# Altium schematic sheet OSPLC2_2_IO4.SchDoc
size 294 x 198 mm
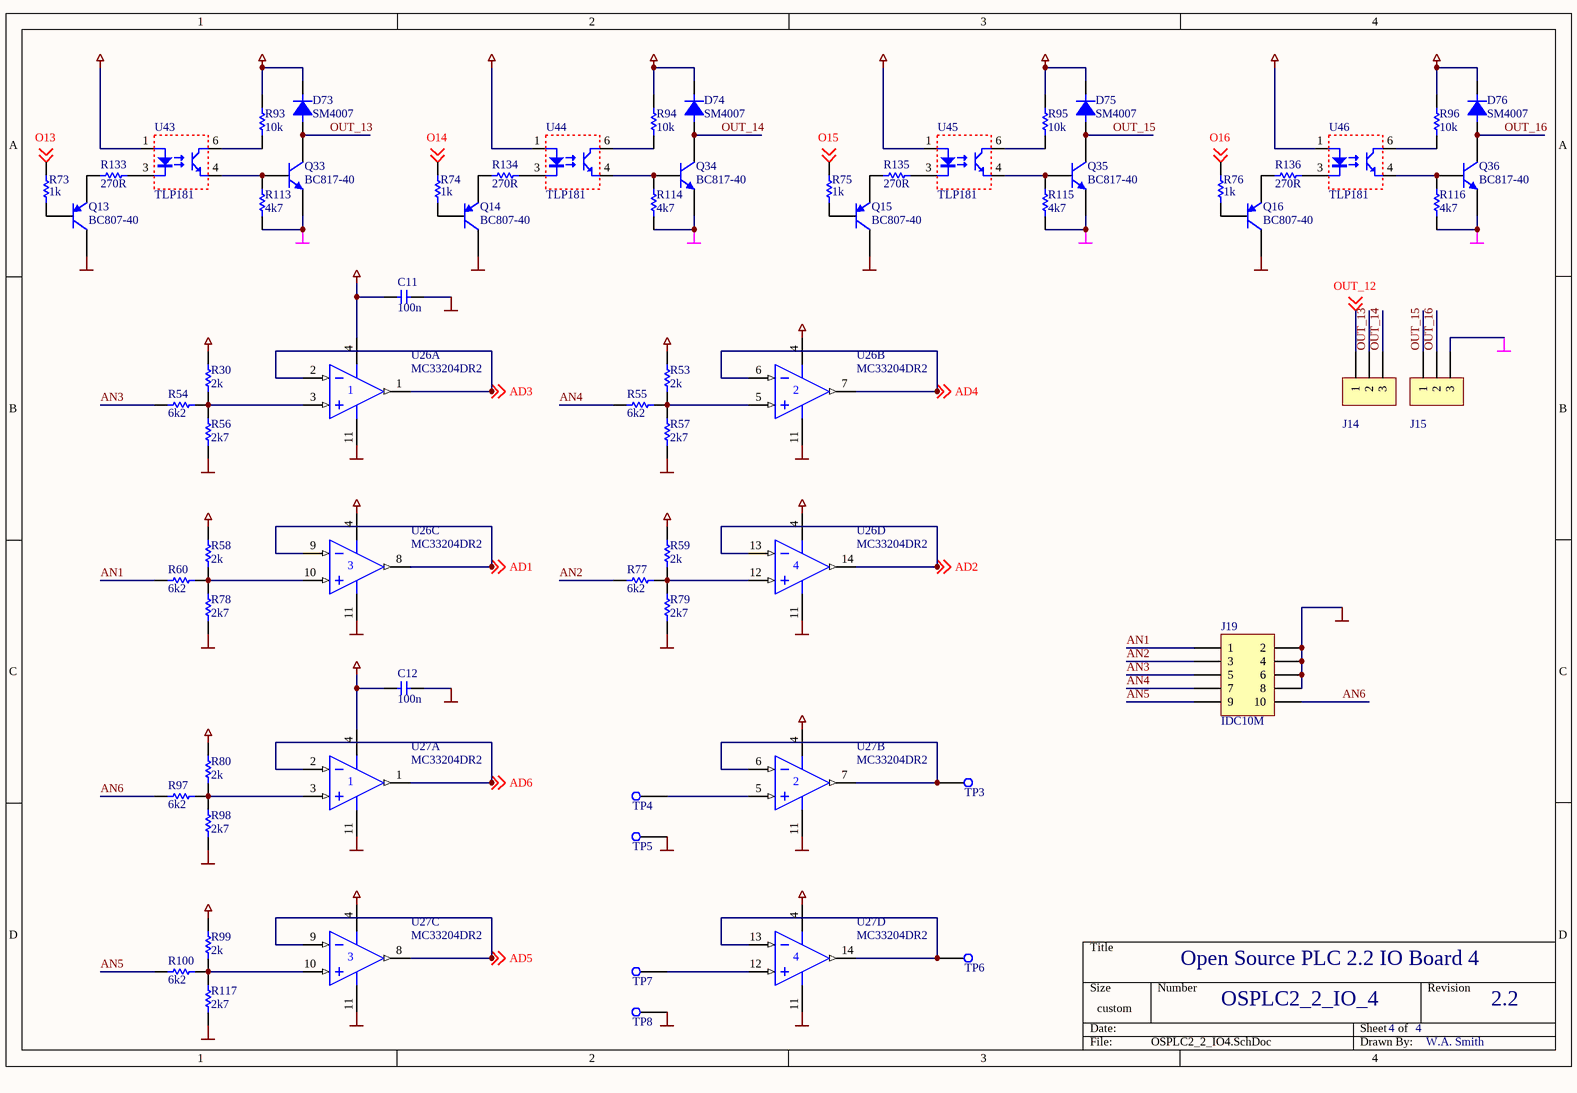
[diagram p0: OSPLC2_2_IO4.SchDoc]

## Parts
C11  value 100n  [0603]  (hidden comment: 0603)
C12  value 100n  [0603]  (hidden comment: 0603)
D73  SM4007  [MELF-2.2x2.5]
D74  SM4007  [MELF-2.2x2.5]
D75  SM4007  [MELF-2.2x2.5]
D76  SM4007  [MELF-2.2x2.5]
J14  PCB TERMINAL  [TERMINAL_3WAY_5MM]  (value not drawn)
J15  PCB TERMINAL  [TERMINAL_3WAY_5MM]  (value not drawn)
J19  IDC10M  [IDC_10M_BOX]
Q13  BC807-40  [SO-G3/Y1]
Q14  BC807-40  [SO-G3/Y1]
Q15  BC807-40  [SO-G3/Y1]
Q16  BC807-40  [SO-G3/Y1]
Q33  BC817-40  [SO-G3/Y1]
Q34  BC817-40  [SO-G3/Y1]
Q35  BC817-40  [SO-G3/Y1]
Q36  BC817-40  [SO-G3/Y1]
R30  value 2k  [0805]  (hidden comment: 0805)
R53  value 2k  [0805]  (hidden comment: 0805)
R54  value 6k2  [0805]  (hidden comment: 0805)
R55  value 6k2  [0805]  (hidden comment: 0805)
R56  value 2k7  [0805]  (hidden comment: 0805)
R57  value 2k7  [0805]  (hidden comment: 0805)
R58  value 2k  [0805]  (hidden comment: 0805)
R59  value 2k  [0805]  (hidden comment: 0805)
R60  value 6k2  [0805]  (hidden comment: 0805)
R73  value 1k  [0805]  (hidden comment: 0805)
R74  value 1k  [0805]  (hidden comment: 0805)
R75  value 1k  [0805]  (hidden comment: 0805)
R76  value 1k  [0805]  (hidden comment: 0805)
R77  value 6k2  [0805]  (hidden comment: 0805)
R78  value 2k7  [0805]  (hidden comment: 0805)
R79  value 2k7  [0805]  (hidden comment: 0805)
R80  value 2k  [0805]  (hidden comment: 0805)
R93  value 10k  [0805]  (hidden comment: 0805)
R94  value 10k  [0805]  (hidden comment: 0805)
R95  value 10k  [0805]  (hidden comment: 0805)
R96  value 10k  [0805]  (hidden comment: 0805)
R97  value 6k2  [0805]  (hidden comment: 0805)
R98  value 2k7  [0805]  (hidden comment: 0805)
R99  value 2k  [0805]  (hidden comment: 0805)
R100  value 6k2  [0805]  (hidden comment: 0805)
R113  value 4k7  [0805]  (hidden comment: 0805)
R114  value 4k7  [0805]  (hidden comment: 0805)
R115  value 4k7  [0805]  (hidden comment: 0805)
R116  value 4k7  [0805]  (hidden comment: 0805)
R117  value 2k7  [0805]  (hidden comment: 0805)
R133  value 270R  [0805]  (hidden comment: 0805)
R134  value 270R  [0805]  (hidden comment: 0805)
R135  value 270R  [0805]  (hidden comment: 0805)
R136  value 270R  [0805]  (hidden comment: 0805)
TP3  TEST POINT  [TEST_POINT_TH]  (value not drawn)
TP4  TEST POINT  [TEST_POINT_TH]  (value not drawn)
TP5  TEST POINT  [TEST_POINT_TH]  (value not drawn)
TP6  TEST POINT  [TEST_POINT_TH]  (value not drawn)
TP7  TEST POINT  [TEST_POINT_TH]  (value not drawn)
TP8  TEST POINT  [TEST_POINT_TH]  (value not drawn)
U26  MC33204DR2  [SO-G14]  (parts A,B,C,D of 4)
U27  MC33204DR2  [SO-G14]  (parts A,B,C,D of 4)
U43  TLP181  [SOP4_2.54]
U44  TLP181  [SOP4_2.54]
U45  TLP181  [SOP4_2.54]
U46  TLP181  [SOP4_2.54]

## Nets
GND: C11.2 C12.2 J19.2 J19.4 J19.6 J19.8 Q13.3(C) Q14.3(C) Q15.3(C) Q16.3(C) R56.1 R57.1 R78.1 R79.1 R98.1 R117.1 TP5.1 TP8.1 U26.11(V-) U27.11(V-)
OUT_GND: J15.3 Q33.2(E) Q34.2(E) Q35.2(E) Q36.2(E) R113.1 R114.1 R115.1 R116.1
VCC3v3: C11.1 C12.1 R30.2 R53.2 R58.2 R59.2 R80.2 R99.2 U26.4(V+) U27.4(V+) U43.1 U44.1 U45.1 U46.1
VCC24: D73.2(C) D74.2(C) D75.2(C) D76.2(C) R93.2 R94.2 R95.2 R96.2
AD1: U26.8(OUT) U26.9(IN-) ; off-sheet AD1
AD2: U26.13(IN-) U26.14(OUT) ; off-sheet AD2
AD3: U26.1(OUT) U26.2(IN-) ; off-sheet AD3
AD4: U26.6(IN-) U26.7(OUT) ; off-sheet AD4
AD5: U27.8(OUT) U27.9(IN-) ; off-sheet AD5
AD6: U27.1(OUT) U27.2(IN-) ; off-sheet AD6
AN1: J19.1 R60.1
AN2: J19.3 R77.1
AN3: J19.5 R54.1
AN4: J19.7 R55.1
AN5: J19.9 R100.1
AN6: J19.10 R97.1
O13: R73.2 ; off-sheet O13
O14: R74.2 ; off-sheet O14
O15: R75.2 ; off-sheet O15
O16: R76.2 ; off-sheet O16
OUT_12: J14.1 ; off-sheet OUT_12
OUT_13: D73.1(A) J14.2 Q33.3(C)
OUT_14: D74.1(A) J14.3 Q34.3(C)
OUT_15: D75.1(A) J15.1 Q35.3(C)
OUT_16: D76.1(A) J15.2 Q36.3(C)
NetQ13_1: Q13.1(B) R73.1
NetQ13_2: Q13.2(E) R133.1
NetQ14_1: Q14.1(B) R74.1
NetQ14_2: Q14.2(E) R134.1
NetQ15_1: Q15.1(B) R75.1
NetQ15_2: Q15.2(E) R135.1
NetQ16_1: Q16.1(B) R76.1
NetQ16_2: Q16.2(E) R136.1
NetQ33_1: Q33.1(B) R113.2 U43.4
NetQ34_1: Q34.1(B) R114.2 U44.4
NetQ35_1: Q35.1(B) R115.2 U45.4
NetQ36_1: Q36.1(B) R116.2 U46.4
NetR30_1: R30.1 R54.2 R56.2 U26.3(IN+)
NetR53_1: R53.1 R55.2 R57.2 U26.5(IN+)
NetR58_1: R58.1 R60.2 R78.2 U26.10(IN+)
NetR59_1: R59.1 R77.2 R79.2 U26.12(IN+)
NetR80_1: R80.1 R97.2 R98.2 U27.3(IN+)
NetR93_1: R93.1 U43.6
NetR94_1: R94.1 U44.6
NetR95_1: R95.1 U45.6
NetR96_1: R96.1 U46.6
NetR99_1: R99.1 R100.2 R117.2 U27.10(IN+)
NetR133_2: R133.2 U43.3
NetR134_2: R134.2 U44.3
NetR135_2: R135.2 U45.3
NetR136_2: R136.2 U46.3
NetTP3_1: TP3.1 U27.6(IN-) U27.7(OUT)
NetTP4_1: TP4.1 U27.5(IN+)
NetTP6_1: TP6.1 U27.13(IN-) U27.14(OUT)
NetTP7_1: TP7.1 U27.12(IN+)

## Notes on the sheet
- Open Source PLC 2.2 IO Board 4
- OSPLC2_2_IO_4
- 2.2
- 4
- W.A. Smith

## Library data of the parts
C11 C12 = CAP_0603: 0603 footprint non-polorised capacitor
D73-D76 = SM4007: 1A, 1000V MELF Rectifier; Value: SM4007
J14 J15 = TERMINAL_3WAY_5MM: 5mm spaced PCB terminal, 3 pole
J19 = IDC_10M: 10 pin IDC male connector, vertical, box
Q13-Q16 = BC807-40: PNP General Purpose Amplifier; Manufacturer: Fairchild Semiconductor; Revision 1: 11-July-2000: SIM Model Added.; Revision 2: July-2002: Re-released for DXP Platform.; Package Information: Latest Revision: Sep-1998; Class I: Discrete; Class II: BJT - Low Power; Published: 8-Jun-2000; Datasheet: Latest Revision: 1997; Package Reference: SOT-23A; Publisher: Altium Limited
Q33-Q36 = BC817-40: NPN General Purpose Amplifier; Manufacturer: Fairchild Semiconductor; Revision 1: 11-July-2000: SIM Model Added.; Revision 2: July-2002: Re-released for DXP Platform.; Package Information: Latest Revision: Sep-1998; Class I: Discrete; Class II: BJT - Low Power; Published: 8-Jun-2000; Datasheet: Latest Revision: 1997; Package Reference: SOT-23A; Publisher: Altium Limited
R30 R53-R60 R73-R80 R93-R100 R113-R117 R133-R136 = RES_0805: 0805 footprint resistor
TP3-TP8 = TEST_POINT_TH: Through hole test point
U26 U27 = MC33204DR2: Rail-to-Rail Quad Operational Amplifier; Manufacturer: Motorola; Package Information: Latest Revision: May-1997; Published: 15-Apr-2002; Revision: 23-Sep-2002: SIM Model Added.; Datasheet: Latest Revision: Nov-1999; Package Reference: 751A-03; Publisher: Altium Limited; Class I: Amplifier; Class II: Operational Amplifier
U43-U46 = TLP181: Toshiba Photocoupler